# EAGLE design SpringReverbRev2_combined (EAGLE 7.7.0)
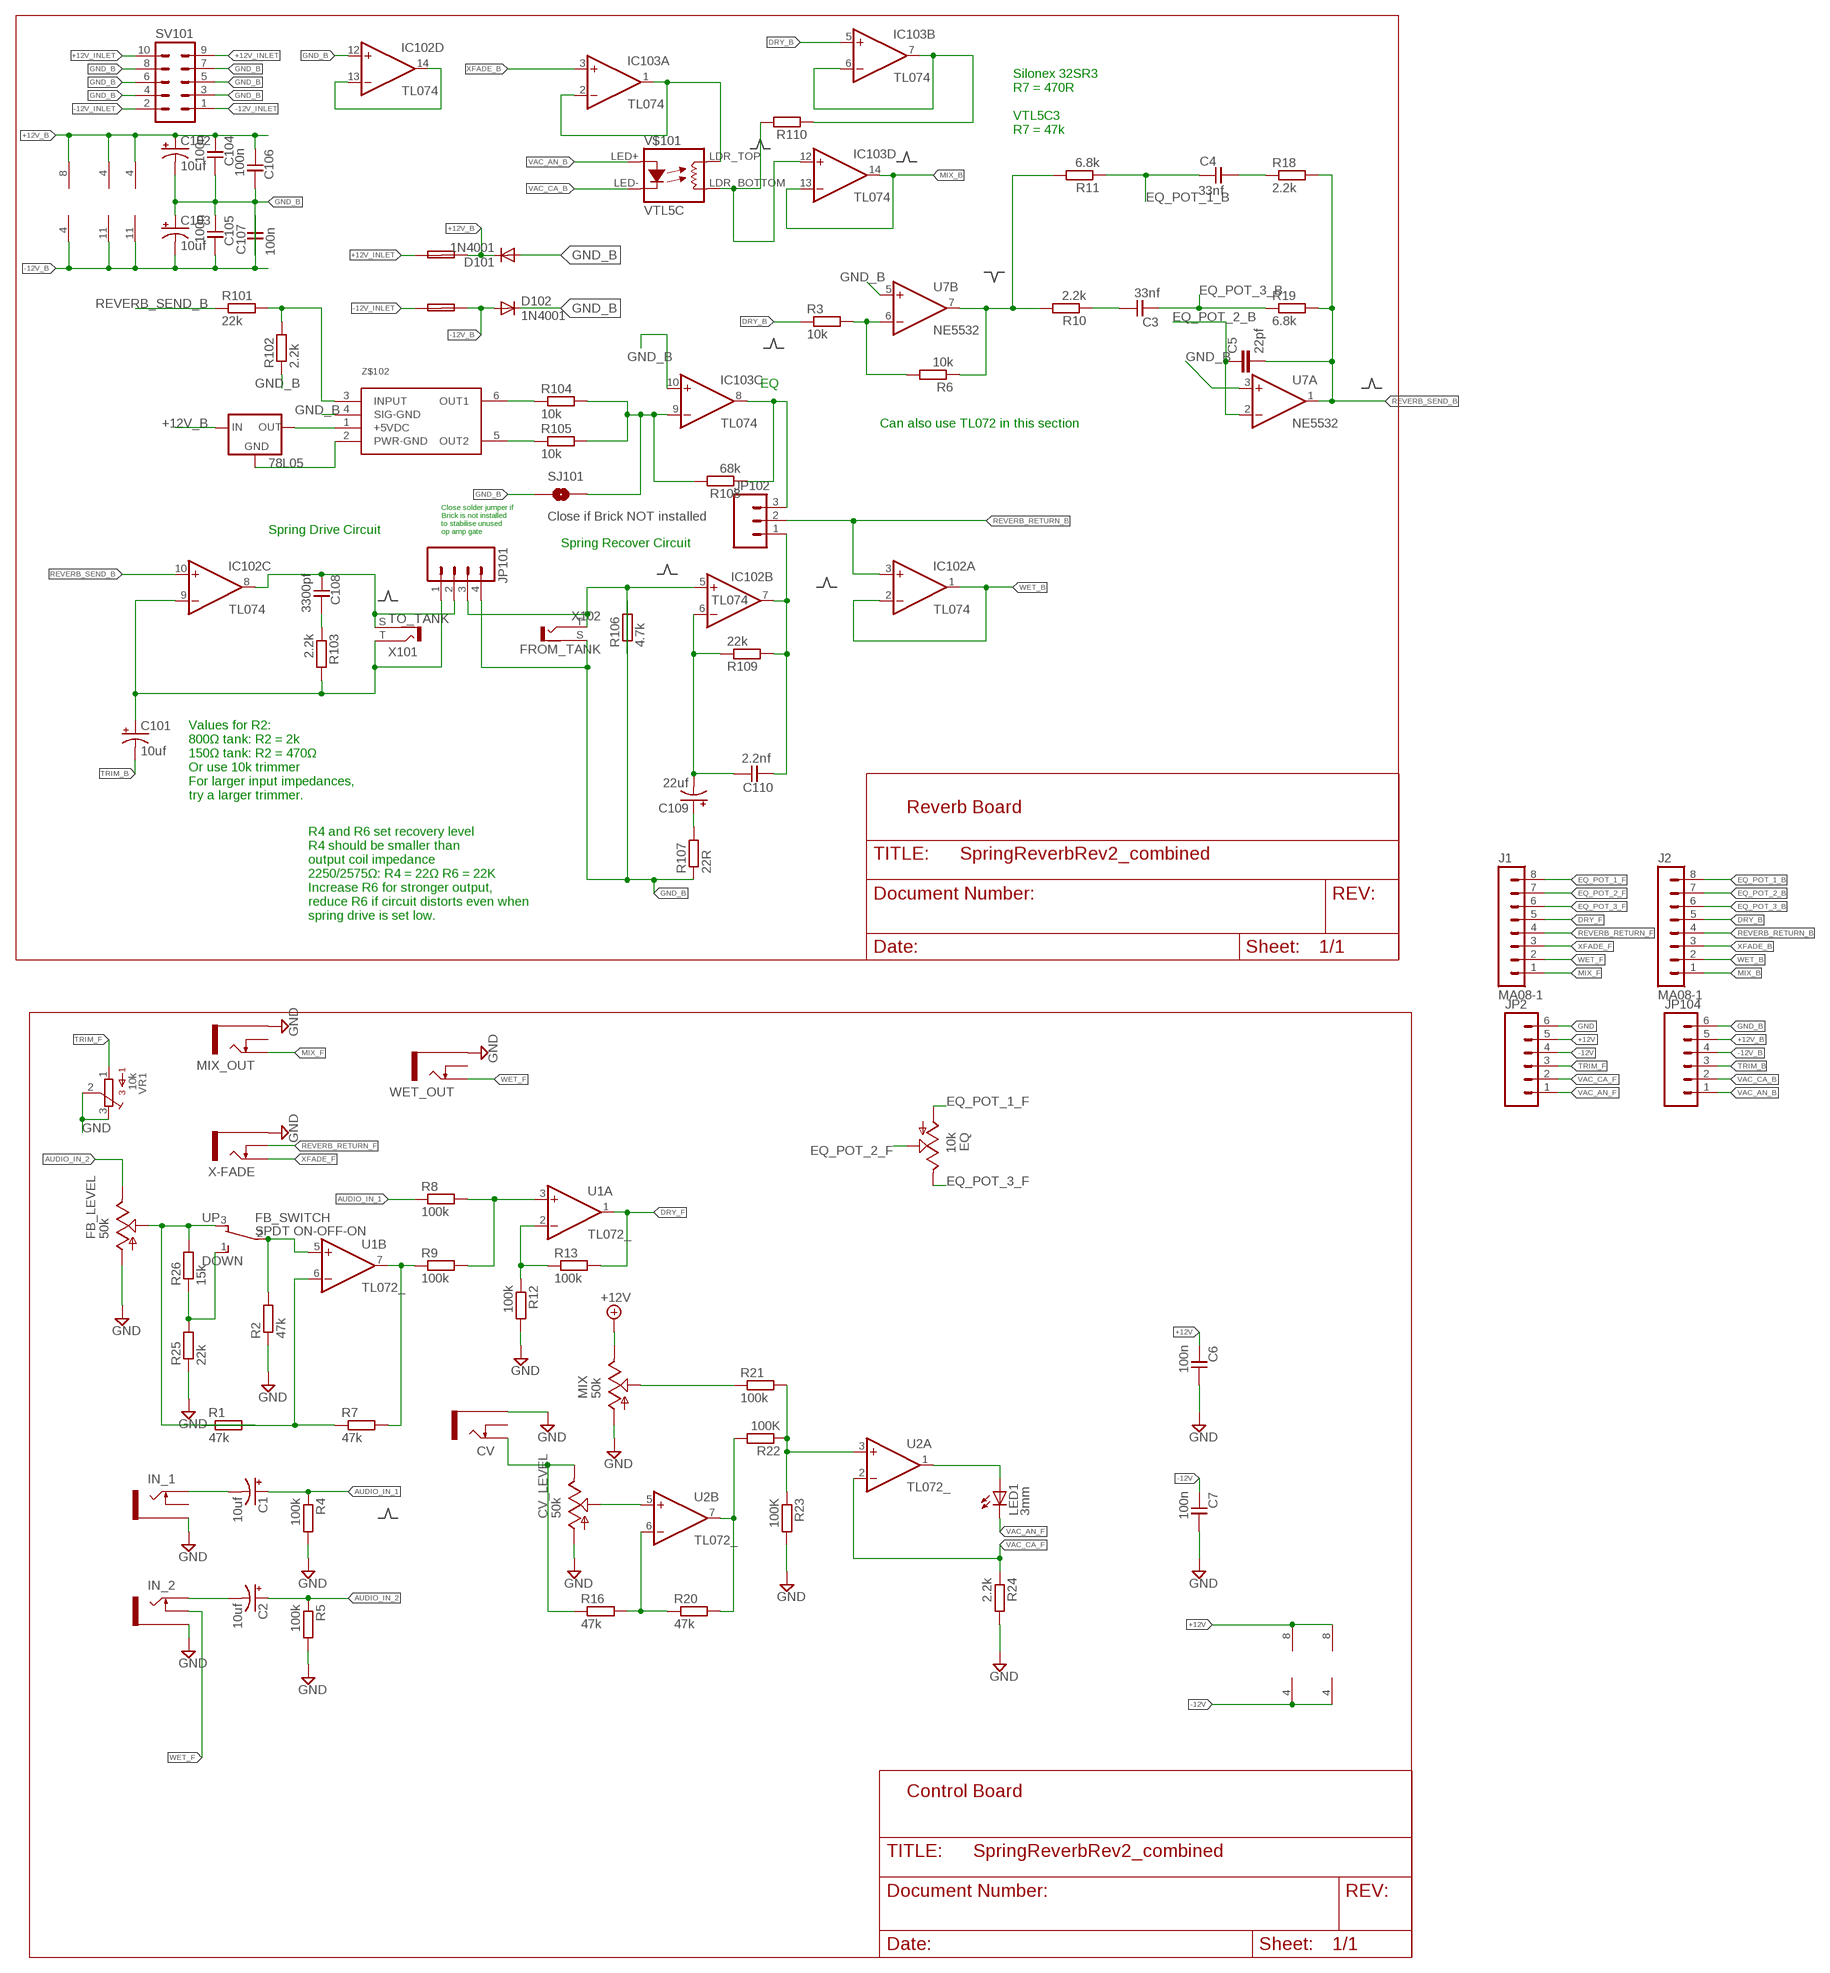
[diagram p0: schematic, sheet 1]

## Parts
78L05  78LXX  [78LXX]
C1  10uf  050  [050_020]
C2  10uf  050  [050_020]
C3  33nf  C-EU050-024X044  [C050-024X044]
C4  33nf  C-EU050-024X044  [C050-024X044]
C5  22pf  050X030_0251  [050X030_025]
C6  100n  C-EU050-024X044  [C050-024X044]
C7  100n  C-EU050-024X044  [C050-024X044]
C101  10uf  CAP_POLPTH2  [CPOL-RADIAL-10UF-25V]
C102  10uf  CAP_POLPTH2  [CPOL-RADIAL-10UF-25V]
C103  10uf  CAP_POLPTH2  [CPOL-RADIAL-10UF-25V]
C104  100n  C-EU050-024X044  [C050-024X044]
C105  100n  C-EU050-024X044  [C050-024X044]
C106  100n  C-EU050-024X044  [C050-024X044]
C107  100n  C-EU050-024X044  [C050-024X044]
C108  3300pf  C-EU050-024X044  [C050-024X044]
C109  22uf  CAP_POLPTH2  [CPOL-RADIAL-10UF-25V]
C110  2.2nf  C-EU050-024X044  [C050-024X044]
CV  THONKICONNNEW  [WQP-PJ301M-12_JACK]
CV_LEVEL  50k  ALPHA-9MMF2A  [EVUF]
D101  1N4001  1N4004  [DO41-10]
D102  1N4001  1N4004  [DO41-10]
EQ  10k  ALPHA-9MMF2A  [EVUF]
F101  FUSE  PTC_FUSEPOLY_FUSE  [C050H075X075]
F102  FUSE  PTC_FUSEPOLY_FUSE  [C050H075X075]
FB_LEVEL  50k  ALPHA-9MMF2A  [EVUF]
FB_SWITCH  SPDT ON-OFF-ON  SPDT-VERTICAL-UPTOP-SUBMINI  [SPDT-VERTICAL-TOP-SUBMINI-MULTICOMP]
IC102  TL074  TL074P  [DIL14]
IC103  TL074  TL074P  [DIL14]
IN_1  THONKICONNNEW  [WQP-PJ301M-12_JACK]
IN_2  THONKICONNNEW  [WQP-PJ301M-12_JACK]
J1  MA08-1  [MA08-1]
J2  MA08-1  [MA08-1]
JP2  M06SIP  [1X06]
JP101  M04POLAR  [MOLEX-1X4]
JP102  M03LOCK_NO_SILK  [1X03_LOCK_NO_SILK]
JP104  M06SIP  [1X06]
LED1  3mm  LED3MM  [LED3MM]
MIX  50k  ALPHA-9MMF2A  [EVUF]
MIX_OUT  THONKICONNNEW  [WQP-PJ301M-12_JACK]
R1  47k  RESISTOR7MM  [7MM_RESISTOR]
R2  47k  RESISTOR7MM  [7MM_RESISTOR]
R3  10k  RESISTOR7MM  [7MM_RESISTOR]
R4  100k  RESISTOR7MM  [7MM_RESISTOR]
R5  100k  RESISTOR7MM  [7MM_RESISTOR]
R6  10k  RESISTOR7MM  [7MM_RESISTOR]
R7  47k  RESISTOR7MM  [7MM_RESISTOR]
R8  100k  RESISTOR7MM  [7MM_RESISTOR]
R9  100k  RESISTOR7MM  [7MM_RESISTOR]
R10  2.2k  RESISTOR7MM  [7MM_RESISTOR]
R11  6.8k  RESISTOR7MM  [7MM_RESISTOR]
R12  100k  RESISTOR7MM  [7MM_RESISTOR]
R13  100k  RESISTOR7MM  [7MM_RESISTOR]
R16  47k  RESISTOR7MM  [7MM_RESISTOR]
R18  2.2k  RESISTOR7MM  [7MM_RESISTOR]
R19  6.8k  RESISTOR7MM  [7MM_RESISTOR]
R20  47k  RESISTOR7MM  [7MM_RESISTOR]
R21  100k  RESISTOR7MM  [7MM_RESISTOR]
R22  100K  RESISTOR7MM  [7MM_RESISTOR]
R23  100K  RESISTOR7MM  [7MM_RESISTOR]
R24  2.2k  RESISTOR7MM  [7MM_RESISTOR]
R25  22k  RESISTOR7MM  [7MM_RESISTOR]
R26  15k  RESISTOR7MM  [7MM_RESISTOR]
R101  22k  RESISTOR7MM  [7MM_RESISTOR]
R102  2.2k  RESISTOR7MM  [7MM_RESISTOR]
R103  2.2k  RESISTOR7MM  [7MM_RESISTOR]
R104  10k  RESISTOR7MM  [7MM_RESISTOR]
R105  10k  RESISTOR7MM  [7MM_RESISTOR]
R106  4.7k  RESISTOR7MM  [7MM_RESISTOR]
R107  22R  RESISTOR7MM  [7MM_RESISTOR]
R108  68k  RESISTOR7MM  [7MM_RESISTOR]
R109  22k  RESISTOR7MM  [7MM_RESISTOR]
R110  RESISTOR7MM  [7MM_RESISTOR]
SJ101  Close if Brick NOT installed  SOLDERJUMPERNC2  [SJ_2S-NOTRACE]
SV101  10_PIN_HEADER  [MA05-2]
U1  TL072_  [DIL08]
U2  TL072_  [DIL08]
U7  NE5532  TL072_  [DIL08]
V$101  VTL5C  VACTROL_COMPACT  [VACTROL_COMPACT]
VR1  10k  BOURNS_3362P_TRIMMERP  [BOURNS_3362P_TRIMMER]
WET_OUT  THONKICONNNEW  [WQP-PJ301M-12_JACK]
X101  TO_TANK  BTOR1  [BTOR1]
X102  FROM_TANK  BTOR1  [BTOR1]
X-FADE  THONKICONNNEW  [WQP-PJ301M-12_JACK]
Z$102  BTDR-2H  [BTDR-2H]

## Nets
+12V [power]: C6.2 JP2.5 MIX.3(E) U1.8(P:V+) U2.8(P:V+)
+12V_B [power]: 78L05.IN C102.1(+) C104.2 C106.2 D101.C F101.1 IC102.4(P:V+) IC103.4(P:V+) JP104.5 U7.8(P:V+)
+12V_INLET: F101.2 SV101.9 SV101.10
-12V [power]: C7.2 JP2.4 U1.4(P:V-) U2.4(P:V-)
-12V_B [power]: C103.2(-) C105.1 C107.1 D102.A F102.1 IC102.11(P:V-) IC103.11(P:V-) JP104.4 U7.4(P:V-)
-12V_INLET: F102.2 SV101.1 SV101.2
AUDIO_IN_1: C1.+ R4.1 R8.1
AUDIO_IN_2: C2.+ FB_LEVEL.3(E) R5.1
AUDIO_IN_BUF: IC103.6(B:-IN) IC103.7(B:OUT) R110.1
BRK: IC103.8(C:OUT) JP102.3 R108.1
CV_F: R20.2 R22.2 U2.7(B:OUT)
DRY_B: IC103.5(B:+IN) J2.5 R3.1
DRY_F: J1.5 R13.2 U1.1(A:OUT)
EQ_POT_1_B: C4.2 J2.8 R11.1
EQ_POT_1_F: EQ.1(A) J1.8
EQ_POT_2_B: C5.1 J2.7 U7.2(A:-IN)
EQ_POT_2_F: EQ.2(S) J1.7
EQ_POT_3_B: C3.2 J2.6 R19.1
EQ_POT_3_F: EQ.3(E) J1.6
GND [ground]: C6.1 C7.1 CV.P$3_SLEEVE(SLEEVE) CV_LEVEL.1(A) FB_LEVEL.1(A) IN_1.P$3_SLEEVE(SLEEVE) IN_2.P$3_SLEEVE(SLEEVE) JP2.6 MIX.1(A) MIX_OUT.P$3_SLEEVE(SLEEVE) R2.1 R4.2 R5.2 R12.2 R23.2 R24.2 R25.1 VR1.2 VR1.3 WET_OUT.P$3_SLEEVE(SLEEVE) X-FADE.P$3_SLEEVE(SLEEVE)
GND_B [ground]: C102.2(-) C103.1(+) C104.1 C105.2 C106.1 C107.2 D101.A D102.C IC102.12(D:+IN) IC103.10(C:+IN) JP101.4 JP104.6 R102.1 R106.2 R107.1 SJ101.1 SV101.3 SV101.4 SV101.5 SV101.6 SV101.7 SV101.8 U7.3(A:+IN) U7.5(B:+IN) X102.S Z$102.4(SIG-GND)
MIX_B: IC103.13(D:-IN) IC103.14(D:OUT) J2.1
MIX_F: J1.1 MIX_OUT.P$1_TIP(TIP)
N$1: C1.- IN_1.P$1_TIP(TIP)
N$2: C2.- IN_2.P$1_TIP(TIP)
N$3: MIX.2(S) R21.1
N$4: FB_LEVEL.2(S) FB_SWITCH.3 R1.2 R26.2
N$5: R1.1 R7.1 U1.6(B:-IN)
N$6: R7.2 R9.1 U1.7(B:OUT)
N$7: R8.2 R9.2 U1.3(A:+IN)
N$8: R21.2 R22.1 R23.1 U2.3(A:+IN)
N$9: R12.1 R13.1 U1.2(A:-IN)
N$10: CV.P$1_TIP(TIP) CV_LEVEL.3(E) R16.1
N$11: LED1.A U2.1(A:OUT)
N$12: FB_SWITCH.1 R25.2 R26.1
N$13: C3.1 R10.1
N$17: C109.1(+) R107.2
N$19: C109.2(-) C110.1 IC102.6(B:-IN) R109.1
N$20: CV_LEVEL.2(S) U2.5(B:+IN)
N$21: C4.1 R18.1
N$23: R16.2 R20.1 U2.6(B:-IN)
N$24: R3.2 R6.2 U7.6(B:-IN)
N$26: C108.1 R103.1
N$27: 78L05.OUT Z$102.1(+5VDC)
N$28: R104.1 Z$102.6(OUT1)
N$29: R105.1 Z$102.5(OUT2)
N$30: IC103.9(C:-IN) R104.2 R105.2 R108.2 SJ101.2
N$31: R6.1 R10.2 R11.2 U7.7(B:OUT)
N$32: R101.2 R102.2 Z$102.3(INPUT)
N$33 [ground]: 78L05.GND Z$102.2(PWR-GND)
N$34 [ground]: IC103.12(D:+IN) R110.2 V$101.LDR_BOTTOM(RES2)
N$35: IC102.13(D:-IN) IC102.14(D:OUT)
N$41: FB_SWITCH.2 R2.2 U1.5(B:+IN)
R+: IC102.5(B:+IN) JP101.3 R106.1 X102.T
REVERB_RETURN_B: IC102.3(A:+IN) J2.4 JP102.2
REVERB_RETURN_F: J1.4 X-FADE.P$2_SWITCH(SWITCH)
REVERB_SEND_B: C5.2 IC102.10(C:+IN) R18.2 R19.2 R101.1 U7.1(A:OUT)
S+: C101.1(+) IC102.9(C:-IN) JP101.1 R103.2 X101.T
S-: C108.2 IC102.8(C:OUT) JP101.2 X101.S
SPNG: C110.2 IC102.7(B:OUT) JP102.1 R109.2
TRIM_B: C101.2(-) JP104.3
TRIM_F: JP2.3 VR1.1
VAC_AN_B: JP104.1 V$101.LED+
VAC_AN_F: JP2.1 LED1.K(C)
VAC_CA_B: JP104.2 V$101.LED-
VAC_CA_F: JP2.2 R24.1 U2.2(A:-IN)
WET_B: IC102.1(A:OUT) IC102.2(A:-IN) J2.2
WET_F: IN_2.P$2_SWITCH(SWITCH) J1.2 WET_OUT.P$1_TIP(TIP)
X_FADE_IN: IC103.1(A:OUT) IC103.2(A:-IN) V$101.LDR_TOP(RES1)
XFADE_B: IC103.3(A:+IN) J2.3
XFADE_F: J1.3 X-FADE.P$1_TIP(TIP)
Unconnected: CV.P$2_SWITCH(SWITCH) IN_1.P$2_SWITCH(SWITCH) MIX_OUT.P$2_SWITCH(SWITCH) WET_OUT.P$2_SWITCH(SWITCH) X101.S@1 X101.S@2 X101.S@3 X102.S@1 X102.S@2 X102.S@3

## Notes on the sheet
- Silonex 32SR3 
  R7 = 470R
  
  VTL5C3 
  R7 = 47k
- EQ
- Can also use TL072 in this section
- Spring Drive Circuit
- Close solder jumper if 
  Brick is not installed
  to stabilise unused
  op amp gate
- Spring Recover Circuit
- Values for R2:
  800Ω tank: R2 = 2k
  150Ω tank: R2 = 470Ω
  Or use 10k trimmer
  For larger input impedances, 
  try a larger trimmer.
- Reverb Board
- R4 and R6 set recovery level 
  R4 should be smaller than 
  output coil impedance
  2250/2575Ω: R4 = 22Ω R6 = 22K 
  Increase R6 for stronger output, 
  reduce R6 if circuit distorts even when 
  spring drive is set low.
- Control Board

## Library data of the parts
78L05 = v-reg:78LXX: VOLTAGE REGULATOR
C1 C2 = gm-caps-electro-pol:050: 0.22 - 100uF Xicon values at Mouser.com: 10V: 10 - 100uF; 16V: 2.2 - 47uF; 25V: 0.47 - 47uF; 50V: 0.22 - 22uF
C3 C4 C6 C7 C104-C108 C110 = TomW:C-EU: CAPACITOR, European symbol
C5 = gm-caps-ceramic:050X030_025: 47 - 120pF Xicon Ceramic Disc 2.5mm lead spacing
C101-C103 C109 = SparkFun-Passives:CAP_POL: Capacitor Polarized These are standard SMD and PTH capacitors. Normally 10uF, 47uF, and 100uF in electrolytic and tantalum varieties. Always verify the external diameter of the through hole cap, it varies with capacity, voltage, and manufacturer. The EIA devices should be standard.
CV IN_1 IN_2 MIX_OUT WET_OUT X-FADE = MusicThingModular:THONKICONN: 3.5mm socket for Eurorack modular synths
CV_LEVEL EQ FB_LEVEL MIX = TomW:ALPHA-9MM: 9 mm Square Rotary Potentiometers Source: Panasonic
D101 D102 = diode:1N4004: DIODE general purpose rectifier, 1 A
F101 F102 = TomW:PTC_FUSE
FB_SWITCH = Monowave_Switches:SPDT-VERTICAL-UP: Vertical SPDT switch in the up position.; SPICE: R{NAME} {2.NET} {3.NET} 1
IC102 IC103 = linear:TL074: OP AMP
J1 J2 = we-con:MA08-1: Pin Header
JP2 JP104 = SparkFun-Connectors:M06: Header 6 Standard 6-pin 0.1" header. Use with straight break away headers (SKU : PRT-00116), right angle break away headers (PRT-00553), swiss pins (PRT-00743), machine pins (PRT-00117), and female headers (PRT-00115). Molex polarized connector foot print use with SKU : PRT-08094 with associated crimp pins and housings. NOTES ON THE VARIANTS LOCK and LOCK_LONGPADS... This footprint was designed to help hold the alignment of a through-hole component (i.e. 6-pin header) while soldering it into place. You may notice that each hole has been shifted either up or down by 0.005 of an inch from it's more standard position (which is a perfectly straight line). This slight alteration caused the pins (the squares in the middle) to touch the edges of the holes. Because they are alternating, it causes a "brace" to hold the component in place. 0.005 has proven to be the perfect amount of "off-center" position when using our standard breakaway headers. Although looks a little odd when you look at the bare footprint, once you have a header in there, the alteration is very hard to notice. Also,if you push a header all the way into place, it is covered up entirely on the bottom side. This idea of altering the position of holes to aid alignment will be further integrated into the Sparkfun Library for other footprints. It can help hold any component with 3 or more connection pins.
JP101 = SparkFun-Connectors:M04: Header 4 Standard 4-pin 0.1" header. Use with straight break away headers (SKU : PRT-00116), right angle break away headers (PRT-00553), swiss pins (PRT-00743), machine pins (PRT-00117), and female headers (PRT-00115). Molex polarized connector foot print use with SKU : PRT-08231 with associated crimp pins and housings. 1MM SMD Version SKU: PRT-10208
JP102 = SparkFun-Connectors:M03: Header 3 Standard 3-pin 0.1" header. Use with straight break away headers (SKU : PRT-00116), right angle break away headers (PRT-00553), swiss pins (PRT-00743), machine pins (PRT-00117), and female headers (PRT-00115). Molex polarized connector foot print use with SKU : PRT-08232 with associated crimp pins and housings.
LED1 = TomW:LED: LED OSRAM: - CHIPLED LG R971, LG N971, LY N971, LG Q971, LY Q971, LO R971, LY R971 LH N974, LH R974 LS Q976, LO Q976, LY Q976 LO Q996 - Hyper CHIPLED LW Q18S LB Q993, LB Q99A, LB R99A - SideLED LS A670, LO A670, LY A670, LG A670, LP A670 LB A673, LV A673, LT A673, LW A673 LH A674 LY A675 LS A676, LA A676, LO A676, LY A676, LW A676 LS A679, LY A679, LG A679 - Hyper Micro SIDELED® LS Y876, LA Y876, LO Y876, LY Y876 LT Y87S - SmartLED LW L88C, LW L88S LB L89C, LB L89S, LG L890 LS L89K, LO L89K, LY L89K LS L896, LA L896, LO L896, LY L896 - TOPLED LS T670, LO T670, LY T670, LG T670, LP T670 LSG T670, LSP T670, LSY T670, LOP T670, LYG T670 LG T671, LOG T671, LSG T671 LB T673, LV T673, LT T673, LW T673 LH T674 LS T676, LA T676, LO T676, LY T676, LB T676, LH T676, LSB T676, LW T676 LB T67C, LV T67C, LT T67C, LS T67K, LO T67K, LY T67K, LW E67C LS E67B, LA E67B, LO E67B, LY E67B, LB E67C, LV E67C, LT E67C LW T67C LS T679, LY T679, LG T679 LS T770, LO T770, LY T770, LG T770, LP T770 LB T773, LV T773, LT T773, LW T773 LH T774 LS E675, LA E675, LY E675, LS T675 LS T776, LA T776, LO T776, LY T776, LB T776 LHGB T686 LT T68C, LB T68C - Hyper Mini TOPLED® LB M676 - Mini TOPLED Santana® LG M470 LS M47K, LO M47K, LY M47K Source: http://www.osram.convergy.de LUXEON: - LUMILED® LXK2-PW12-R00, LXK2-PW12-S00, LXK2-PW14-U00, LXK2-PW14-V00 LXK2-PM12-R00, LXK2-PM12-S00, LXK2-PM14-U00 LXK2-PE12-Q00, LXK2-PE12-R00, LXK2-PE12-S00, LXK2-PE14-T00, LXK2-PE14-U00 LXK2-PB12-K00, LXK2-PB12-L00, LXK2-PB12-M00, LXK2-PB14-N00, LXK2-PB14-P00, LXK2-PB14-Q00 LXK2-PR12-L00, LXK2-PR12-M00, LXK2-PR14-Q00, LXK2-PR14-R00 LXK2-PD12-Q00, LXK2-PD12-R00, LXK2-PD12-S00 LXK2-PH12-R00, LXK2-PH12-S00 LXK2-PL12-P00, LXK2-PL12-Q00, LXK2-PL12-R00 Source: www.luxeon.com KINGBRIGHT: KA-3528ASYC Source: www.kingbright.com
R1-R13 R16 R18-R26 R101-R110 = MusicThingModular:RESISTOR: Standard resistor, various versions
SJ101 = SparkFun-Passives:SOLDERJUMPER: Solder Jumper Standard SMD solder jumper. Used to automate production. Two varients : Normally Open and Normally Closed are the same, but have different paste layers. NC will have a large amount of paste and should jumper during reflow.
SV101 = TomW:10_PIN_HEADER: PIN HEADER; OC_FARNELL: unknown; OC_NEWARK: unknown
U1 U2 U7 = MusicThingModular:TL072: Generic Dual Op Amp
V$101 = TomW:VACTROL_COMPACT
VR1 = MusicThingModular:BOURNS_3362P_TRIMMER: 3362 Series 1/4" Square Trimmer
X101 X102 = con-lumberg:BTOR1: RCA connectors according to JEITA RC-5231 Cinch RCA-Einbaukupplung nach JEITA RC-5231, stehende Ausführung Source: http://www.lumberg.de/Produkte/PDFs/BTOR1.pdf; MPN: BTOR 1; OC_FARNELL: 1217030; OC_NEWARK: 96K7172
Z$102 = Accutronics BTDR-2H:BTDR-2H: Accutronics BTDR-2H Information: http://www.accutronicsreverb.com/main/?skin=sub01_05_1.html

## Net classes
0 default: width 0.203 mm
1 power: width 0.406 mm

## Board
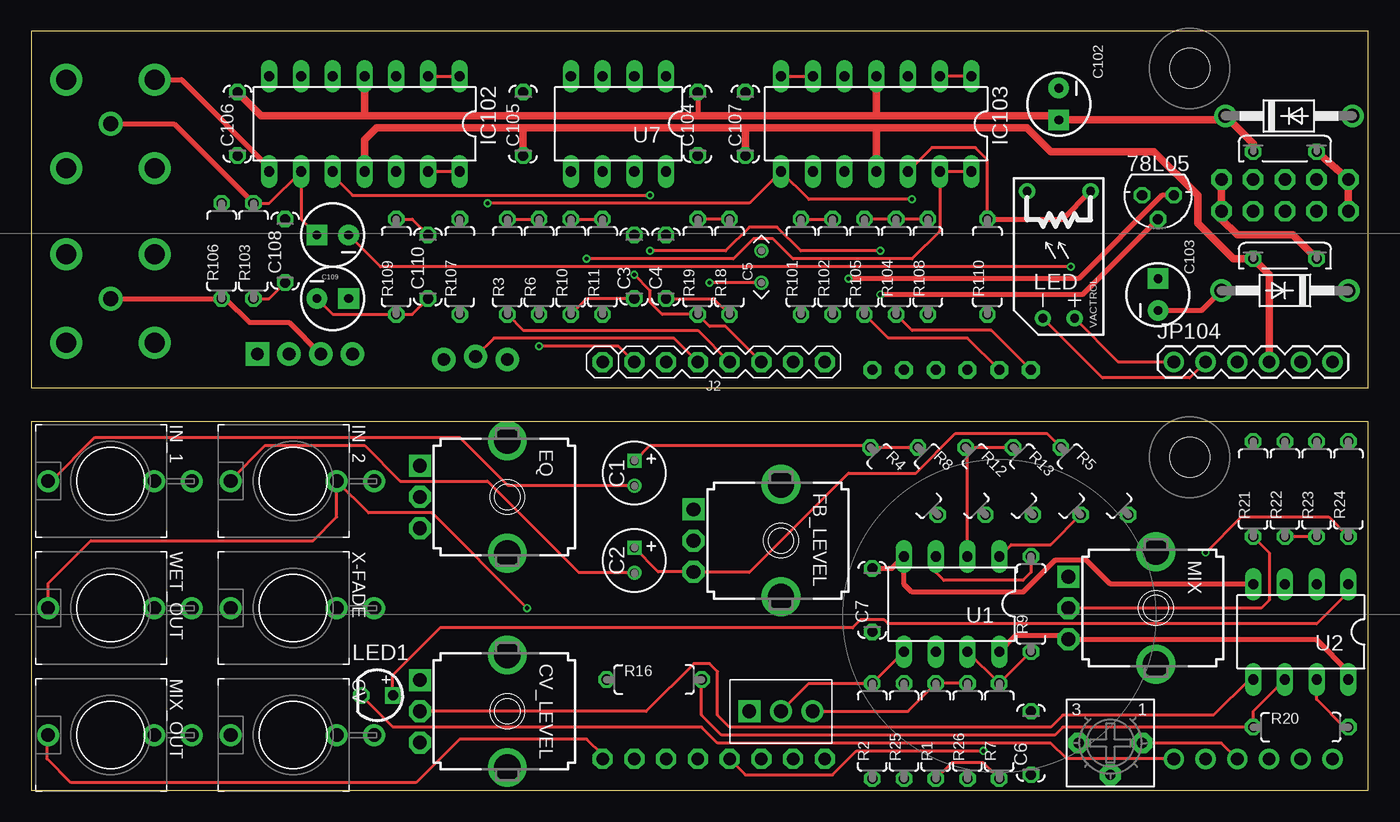
[diagram p1: board, top side]
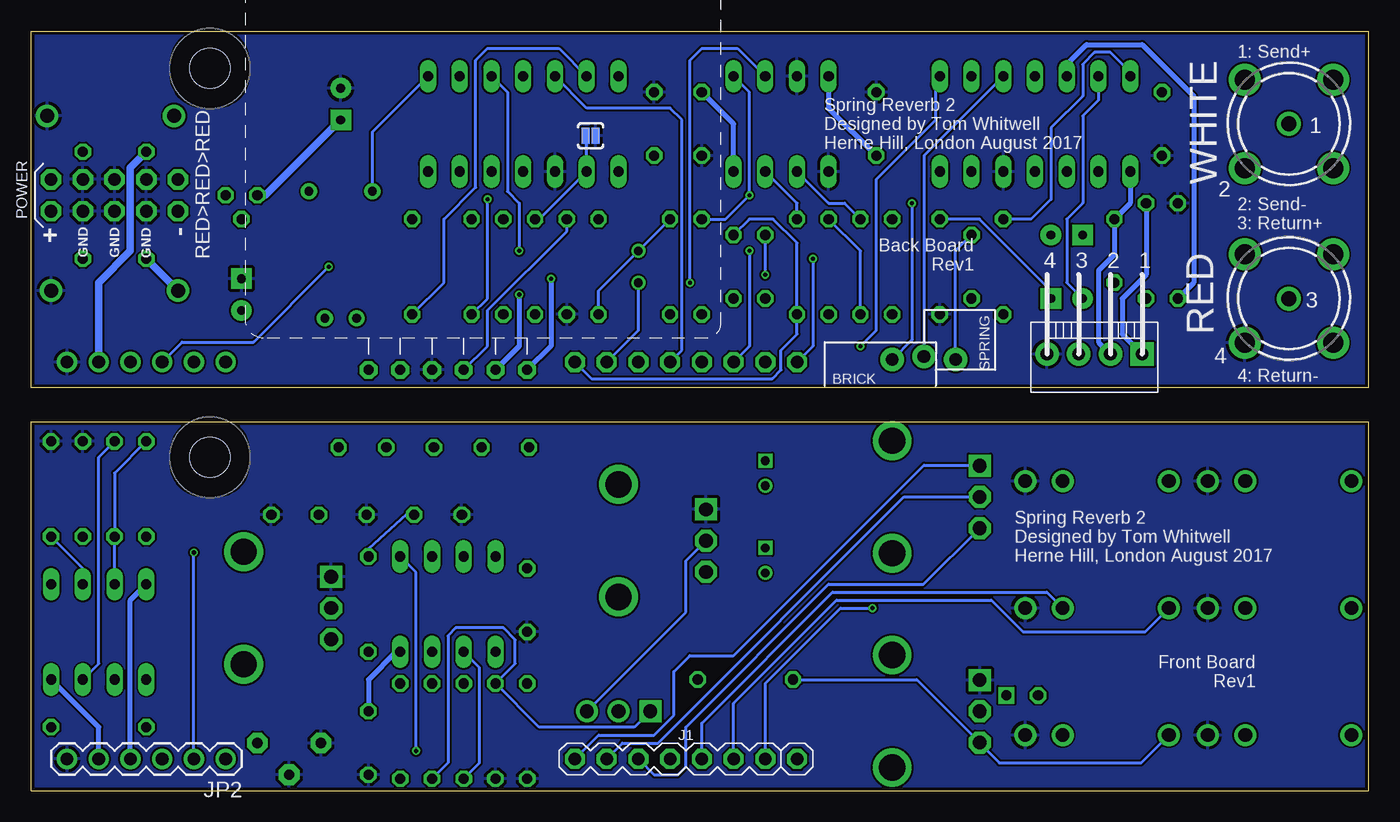
[diagram p2: board, bottom side, seen from below]

Size 107 x 60.75 mm. Coordinates in mm from the lower left corner, seen from the top.
Outline: 107,0 107,29.5 0,29.5 0,0 107,0
Outline: 0,60.75 0,32.25 107,32.25 107,60.75 0,60.75
Copper layers (1*16): Top 0.035mm / dielectric 0.2mm / Bottom 0.035mm
Design rules "SeeedStudio_DRU_no_angle_20130527 *": minimum track width 6mil, minimum drill 12mil, track to track 6mil, track to pad 6mil, pad to pad 6mil, via to via 6mil, smd to smd 0mil, copper to edge 10mil, drill to drill 10mil, minimum pad ring 6mil, minimum via ring 6mil, stop-mask expansion 2mil, vias tented up to drill 25mil, thermal gap 10mil

### Footprints (pad centres in the part's own frame; a part is rotated, then mirrored left to right if it is on the bottom)
78LXX = drill 0.813 octagon: GND 0,1.905; IN 1.27,0; OUT -1.27,0
050_020 = drill 0.7 square: + -1,0 | drill 0.7: - 1,0
C050-024X044 = drill 0.813 octagon: 1 -2.54,0; 2 2.54,0
050X030_025 = drill 0.7: 1 -1.27,0; 2 1.27,0
CPOL-RADIAL-10UF-25V = drill 0.7 pad 1.651 square: 1 1.27,0 | drill 0.7 pad 1.651: 2 -1.27,0
WQP-PJ301M-12_JACK = drill 1.1: P$1_TIP 0,5; P$2_SWITCH 0,-3.5; P$3_SLEEVE 0,-6.5
EVUF = drill 1.1 square: 1 -2.5,-7 | drill 1.1 octagon: 2 0,-7; 3 2.5,-7 | drill 2.1: M1 4.5,0; M2 -4.5,0
DO41-10 = drill 1.118: A 5.08,0; C -5.08,0
C050H075X075 = drill 0.813 octagon: 1 -2.54,0; 2 2.54,0
SPDT-VERTICAL-TOP-SUBMINI-MULTICOMP = drill 1.1 square: 1 0,2.54 | drill 1.1: 2 0,0; 3 0,-2.54
DIL14 = drill 0.813 long: 1 -7.62,-3.81; 2 -5.08,-3.81; 3 -2.54,-3.81; 4 0,-3.81; 5 2.54,-3.81; 6 5.08,-3.81; 7 7.62,-3.81; 8 7.62,3.81; 9 5.08,3.81; 10 2.54,3.81; 11 0,3.81; 12 -2.54,3.81; 13 -5.08,3.81; 14 -7.62,3.81
MA08-1 = drill 1 octagon: 1 0,8.89; 2 0,6.35; 3 0,3.81; 4 0,1.27; 5 0,-1.27; 6 0,-3.81; 7 0,-6.35; 8 0,-8.89
1X06 = drill 1.016: 1 0,0; 2 2.54,0; 3 5.08,0; 4 7.62,0; 5 10.16,0; 6 12.7,0
MOLEX-1X4 = drill 1.016 pad 1.88 square: 1 0,0 | drill 1.016 pad 1.88: 2 2.54,0; 3 5.08,0; 4 7.62,0
1X03_LOCK_NO_SILK = drill 1.016 pad 1.88: 1 0,0.127; 2 2.54,-0.127; 3 5.08,0.127
LED3MM = drill 0.813 square: A -1.27,0 | drill 0.813 octagon: K 1.27,0
7MM_RESISTOR = drill 0.813 octagon: 1 -3.81,0; 2 3.81,0
SJ_2S-NOTRACE = smd 0.635 x 1.27: 1 -0.401,0; 2 0.413,0
MA05-2 = drill 1.016 octagon: 1 -5.08,-1.27; 2 -5.08,1.27; 3 -2.54,-1.27; 4 -2.54,1.27; 5 0,-1.27; 6 0,1.27; 7 2.54,-1.27; 8 2.54,1.27; 9 5.08,-1.27; 10 5.08,1.27
DIL08 = drill 0.813 pad 1.27 long: 1 -3.81,-3.81; 2 -1.27,-3.81; 3 1.27,-3.81; 4 3.81,-3.81; 5 3.81,3.81; 6 1.27,3.81; 7 -1.27,3.81; 8 -3.81,3.81
MOUNTING_HOLE = hole 3.2: 0,0
VACTROL_COMPACT = drill 0.7 pad 1.3: LDR_BOTTOM 5.08,-2.54; LDR_TOP 5.08,2.54; LED+ -5.08,-1.27; LED- -5.08,1.27
BOURNS_3362P_TRIMMER = drill 0.813 pad 1.676 octagon: 1 -2.54,0; 2 0,2.54; 3 2.54,0
BTOR1 = drill 1.6 pad 2.2: S -5,0; S@1 0,5; S@2 5,0; S@3 0,-5 | drill 1.2 pad 1.6: T 0,0
BTDR-2H = drill 0.8 pad 1.422 octagon: 1 2.54,-17.78; 2 0,-17.78; 3 -2.54,-17.78; 4 -5.08,-17.78; 5 -7.62,-17.78; 6 -10.16,-17.78

### Placement (x,y rotation side)
78L05  90.17,47.62 180 top
C1  48.26,25.4 270 top
C2  48.26,18.41 270 top
C3  48.26,41.91 90 top
C4  50.8,41.91 90 top
C5  58.42,41.91 90 top
C6  80.01,3.81 90 top
C7  67.31,15.24 90 top
C101  24.13,44.45 180 top
C102  82.23,54.93 270 top
C103  90.17,39.69 90 top
C104  53.34,53.34 90 top
C105  39.37,53.34 90 top
C106  16.51,53.34 90 top
C107  57.15,53.34 90 top
C108  20.32,43.18 90 top
C109  24.13,39.37 0 top
C110  31.75,41.91 90 top
CV  20.95,4.45 90 top
CV_LEVEL  38.1,6.35 270 top
D101  100.65,53.98 0 top
D102  100.33,40.01 180 top
EQ  38.1,23.5 270 top
F101  100.33,51.12 0 top
F102  100.33,42.55 0 top
FB_LEVEL  60,20 270 top
FB_SWITCH  60,6.35 90 top
IC102  26.67,53.34 180 top
IC103  67.63,53.34 180 top
IN_1  6.35,24.77 90 top
IN_2  20.95,24.77 90 top
J1  54.61,2.54 270 bottom
J2  54.61,34.29 90 top
JP2  91.44,2.54 180 bottom
JP101  18.1,34.92 180 bottom
JP102  33.02,34.61 180 bottom
JP104  91.44,34.29 0 top
LED1  27.69,7.62 180 top
MIX  90,14.61 270 top
MIX_OUT  6.35,4.45 90 top
R1  72.39,4.76 90 top
R2  67.31,4.76 90 top
R3  38.1,41.91 90 top
R4  69.85,24.77 315 top
R5  85.09,24.77 315 top
R6  40.64,41.91 90 top
R7  77.47,4.76 90 top
R8  73.66,24.77 315 top
R9  80.01,14.92 90 top
R10  43.18,41.91 90 top
R11  45.72,41.91 90 top
R12  77.47,24.77 315 top
R13  81.28,24.77 315 top
R16  49.85,8.89 0 top
R18  55.88,41.91 90 top
R19  53.34,41.91 90 top
R20  101.6,5.08 0 top
R21  97.79,24.13 90 top
R22  100.33,24.13 90 top
R23  102.87,24.13 90 top
R24  105.41,24.13 90 top
R25  69.85,4.76 90 top
R26  74.93,4.76 90 top
R101  61.59,41.91 90 top
R102  64.14,41.91 90 top
R103  17.78,43.18 90 top
R104  69.22,41.91 90 top
R105  66.67,41.91 90 top
R106  15.24,43.18 90 top
R107  34.29,41.91 90 top
R108  71.75,41.91 90 top
R109  29.21,41.91 90 top
R110  76.52,41.91 90 top
SJ101  62.23,52.39 180 bottom
SV101  100.33,47.62 180 bottom
U1  73.66,14.92 180 top
U2  101.6,12.7 180 top
U7  46.99,53.34 180 top
U$3  [MOUNTING_HOLE]  92.71,26.67 0 top
U$4  [MOUNTING_HOLE]  92.71,57.78 0 top
V$101  82.23,42.86 90 top
VR1  86.36,3.81 180 top
WET_OUT  6.35,14.61 90 top
X101  6.35,53.34 315 bottom
X102  6.35,39.37 45 bottom
X-FADE  20.95,14.61 90 top
Z$102  69.85,51.44 0 bottom

### Tracks (layer width: path | path; a pad name or v marks a point on that pad's centre or on a via)
+12V
  Top 0.406: U1.8 78.74,12.38 82.55,12.38 82.83,12.11 MIX.3 102.83,12.11 105.41,9.53 U2.8
  Bottom 0.406: JP2.5 101.6,5.08 U2.8 | U1.8 77.79,11.11 80.01,8.89 C6.2
+12V_B
  Top 0.406: C102.1 81.92,53.98 | 26.67,54.29 26.35,53.98 | C104.2 53.34,53.98
  Top 0.61: F101.1 97.79,51.75 D101.C 94.93,53.66 C102.1 | 81.92,53.98 67.63,53.98 | 67.63,53.98 53.34,53.98 26.35,53.98 18.41,53.98 C106.2 | IC102.4 26.67,54.29 | IC103.4 67.63,53.98
  Bottom 0.406: U7.8 50.8,53.34 C104.2
  Bottom 0.61: 78L05.IN 88.27,47.62 C102.1 | JP104.5 101.6,40.64 99.06,43.18 99.06,49.85 F101.1
+12V_INLET
  Top 0.61: SV101.10 SV101.9 F101.2
-12V
  Top 0.406: U2.4 86.36,16.51 84.45,18.41 81.92,18.41 79.38,15.88 70.48,15.88 69.85,16.51 U1.4 68.9,17.78 C7.2
  Bottom 0.406: JP2.4 99.06,15.24 U2.4
-12V_B
  Top 0.406: 39.37,52.7 39.69,53.02 | C103.2 93.66,38.42 D102.A
  Top 0.61: 67.63,53.02 79.69,53.02 81.6,51.12 89.85,51.12 93.34,47.62 93.34,45.4 96.2,42.55 F102.1 99.06,41.27 JP104.4 | 67.63,53.02 57.15,53.02 | 57.15,53.02 39.69,53.02 27.62,53.02 26.67,52.07 IC102.11 | C105.1 39.37,52.7 | IC103.11 67.63,53.02 | C107.1 57.15,53.02
  Bottom 0.406: U7.4 43.18,54.61 C105.1
  Bottom 0.61: D102.A F102.1
-12V_INLET
  Top 0.61: SV101.1 SV101.2 95.25,45.72 96.52,44.45 100.97,44.45 F102.2
AUDIO_IN_1
  Top 0.254: C1.+ 48.31,26.35 48.31,26.4 49.53,27.62 66.99,27.62 R4.1 R8.1
AUDIO_IN_2
  Top 0.254: C2.+ 50.17,17.5 FB_LEVEL.3 53.04,17.46 57.47,17.46 65.41,25.4 70.8,25.4 73.98,28.57 81.28,28.57 R5.1
AUDIO_IN_BUF
  Top 0.254: IC103.7 IC103.6
  Bottom 0.254: R110.1 73.98,40.64 73.98,45.72 71.44,48.26 71.44,58.42 70.48,59.37 64.77,59.37 IC103.6
BRK  (via drill 0.33)
  Top 0.254: v70.48,47.31 62.23,47.31 IC103.8 57.47,46.99 v36.51,46.99
  Bottom 0.254: R108.1 70.48,39.37 v70.48,47.31 | v36.51,46.99 36.51,36.07 JP102.3
CV_F
  Top 0.254: R20.2 105.09,5.08 102.87,7.3 U2.7
  Bottom 0.254: U2.7 101.6,10.16 101.6,26.67 R22.2
DRY_B
  Top 0.254: R3.1 39.37,36.83 53.34,36.83 J2.5
  Bottom 0.254: J2.5 54.93,35.24 54.93,53.66 55.88,54.61 62.55,54.61 IC103.5
DRY_F  (via drill 0.33)
  Top 0.254: J1.5 57.15,1.27 64.14,1.27 66.04,3.17 v76.2,3.17 | U1.1 78.42,19.68 81.59,19.68 R13.2
  Bottom 0.254: v76.2,3.17 76.2,17.46 U1.1
EQ_POT_1_B
  Bottom 0.254: J2.8 62.17,32.96 47.69,32.96 46.99,33.66 46.99,35.24 45.72,36.51 R11.1 45.72,43.81 47.62,45.72 49.53,45.72 C4.2
EQ_POT_1_F
  Bottom 0.254: J1.8 61.59,4.45 57.15,4.45 55.56,6.03 55.56,9.53 54.29,10.79 50.8,10.79 35.56,26.04 31.14,26.04 EQ.1
EQ_POT_2_B  (via drill 0.33)
  Top 0.254: C5.1 v54.29,40.64
  Bottom 0.254: J2.7 58.42,36.83 C5.1 | v54.29,40.64 54.29,58.42 53.34,59.37 50.48,59.37 U7.2
EQ_POT_2_F
  Bottom 0.254: J1.7 59.69,3.81 56.83,3.81 37.15,23.5 EQ.2
EQ_POT_3_B  (via drill 0.33)
  Top 0.254: J2.6 55.56,37.15 54.29,37.15 R19.1 50.48,38.1 49.53,39.05 49.53,40.01 v48.26,41.27
  Bottom 0.254: v48.26,41.27 C3.2
EQ_POT_3_F
  Bottom 0.254: J1.6 57.15,1.27 55.24,1.27 54.61,1.91 54.61,5.08 43.18,16.51 35.59,16.51 EQ.3
GND
  pour Bottom: -0.32,29.53 107,29.53 107,0 0,0
GND_B
  pour Bottom: -0.32,32.07 107.31,32.07 107.31,60.96 -0.32,60.96
MIX_B  (via drill 0.33)
  Top 0.254: IC103.14 IC103.13 72.71,44.77 70.48,42.55 60.96,42.55 59.37,44.13 57.78,44.13 56.2,42.55 v44.45,42.55
  Bottom 0.254: v44.45,42.55 44.45,35.56 J2.1
MIX_F
  Top 0.254: J1.1 45.72,2.86 44.45,4.13 34.29,4.13 30.8,0.64 3.17,0.64 1.27,2.54 1.27,4.37 MIX_OUT.P$1_TIP
N$1
  Top 0.254: IN_1.P$1_TIP 1.59,24.77 5.08,28.26 34.29,28.26 38.1,24.45 48.21,24.45 C1.-
N$2
  Top 0.254: IN_2.P$1_TIP 15.96,24.84 18.73,27.62 26.67,27.62 29.53,24.77 36.51,24.77 43.81,17.46 48.21,17.46 C2.-
N$3
  Top 0.254: R21.1 99.06,19.05 99.06,15.24 98.42,14.61 MIX.2
N$4
  Top 0.254: R26.2 R1.2 70.17,6.35 FB_SWITCH.3
  Bottom 0.254: FB_SWITCH.3 54.61,14.29 54.61,18.39 FB_LEVEL.2
N$5
  Top 0.254: R7.1 76.2,2.22 73.66,2.22 R1.1
  Bottom 0.254: R1.1 71.12,2.22 71.12,9.84 U1.6
N$6
  Top 0.254: R9.1 R7.2 U1.7
N$7
  Top 0.254: R9.2 80.01,17.46 79.38,16.83 73.03,16.83 72.39,17.46 U1.3
  Bottom 0.254: R8.2 76.99,22.07 80.01,19.37 R9.2
N$8
  Top 0.254: R23.1 R22.1
  Bottom 0.254: R21.2 100.33,25.4 R22.1 U2.3
N$9
  Top 0.254: U1.2 74.93,27.3 R12.1 R13.1
N$10
  Bottom 0.254: R16.1 36.14,8.89 CV_LEVEL.3 31.1,3.79 29.53,2.22 18.18,2.22 CV.P$1_TIP
N$11
  Top 0.254: U2.1 105.41,15.88 102.87,13.34 68.58,13.34 68.26,13.65 66.36,13.65 65.72,13.02 32.7,13.02 28.89,9.21 28.89,7.68 LED1.A
N$12
  Bottom 0.254: FB_SWITCH.1 58.74,5.08 66.36,5.08 R25.2 68.26,10.16 68.26,12.06 69.22,13.02 73.03,13.02 73.66,12.38 73.66,2.22 R26.1
N$13
  Top 0.254: C3.1 44.45,39.37 R10.1
N$17
  Bottom 0.254: C109.1 25.4,40.01 31.11,45.72 R107.2
N$19
  Top 0.254: C109.2 24.13,38.1 R109.1 30.48,38.1 C110.1
  Bottom 0.254: C109.2 24.13,40.64 24.13,45.72 22.86,46.99 22.86,53.98 21.59,55.24 IC102.6
N$20
  Top 0.254: U2.5 97.47,8.89 94.61,6.03 82.55,6.03 81.6,5.08 55.88,5.08 54.93,6.03 54.93,9.53 54.29,10.16 53.02,10.16 49.21,6.35 CV_LEVEL.2
N$21
  Top 0.254: C4.1 54.61,39.37 R18.1
N$23
  Top 0.254: U2.6 97.79,6.35 R20.1 82.55,5.08 81.92,4.45 55.24,4.45 53.66,6.03 R16.2
N$24
  Top 0.254: R3.2 R6.2
  Bottom 0.254: U7.6 43.18,46.99 41.91,46.99 R6.2
N$26
  Top 0.254: R103.1 19.05,39.37 C108.1
N$27  (via drill 0.33)
  Top 0.406: 78L05.OUT 90.49,47.62 83.82,40.96 v65.41,40.96
  Bottom 0.406: v65.41,40.96 65.41,35.56 Z$102.1
N$28
  Top 0.254: Z$102.6 76.83,36.83 70.48,36.83 R104.1
N$29
  Top 0.254: Z$102.5 74.93,36.2 68.58,36.2 R105.1
N$30
  Top 0.254: R108.2 R104.2 R105.2
  Bottom 0.254: R105.2 66.36,45.72 IC103.9 62.55,51.66 SJ101.2
N$31
  Top 0.254: R10.2 R11.2
  Bottom 0.254: R6.1 40.64,43.18 R10.2 | R11.2 45.72,46.99 U7.7
N$32
  Top 0.254: R101.2 R102.2
  Bottom 0.254: Z$102.3 70.48,35.56 70.48,38.42 64.14,44.77 R102.2
N$33  (via drill 0.33)
  Top 0.406: 78L05.GND 84.14,39.69 v67.94,39.69
  Bottom 0.406: v67.94,39.69 67.94,35.56 Z$102.2
N$34
  Top 0.254: R110.2 76.52,50.48 75.56,51.44 72.07,51.44 IC103.12
  Top 0.406: R110.2 82.55,45.72 V$101.LDR_BOTTOM
N$35
  Top 0.254: IC102.14 IC102.13
N$41
  Top 0.254: FB_SWITCH.2 62.23,8.57 R2.2 U1.5
R+
  Top 0.406: X102.T R106.1 15.56,39.37 17.46,37.47 20.64,37.47 JP101.3
  Bottom 0.406: IC102.5 24.13,58.1 22.54,59.69 18.1,59.69 13.97,55.56 13.97,40.64 R106.1
REVERB_RETURN_B
  Top 0.254: J2.4 51.44,36.2 37.02,36.2 JP102.2
  Bottom 0.254: IC102.3 35.56,50.8 JP102.2
REVERB_RETURN_F
  Bottom 0.254: J1.4 53.34,5.4 42.86,15.88 25.73,15.88 X-FADE.P$2_SWITCH
REVERB_SEND_B  (via drill 0.33)
  Top 0.254: R18.2 R19.2 | IC102.10 24.13,49.21 25.72,47.62 v49.53,47.62
  Bottom 0.254: R101.1 61.59,40.01 C5.2 R18.2 | R19.2 51.44,45.72 v49.53,47.62 49.53,55.88 U7.1
S+
  Top 0.254: R103.2 19.05,46.99 IC102.9 21.59,45.72 C101.1
  Top 0.406: X101.T 11.43,53.34 R103.2
  Bottom 0.406: R103.2 17.78,41.27 19.68,39.37 19.68,36.51 JP101.1
S-
  Top 0.254: 19.05,49.85 IC102.8
  Top 0.406: X101.S 12.02,56.88 19.05,49.85
  Bottom 0.406: IC102.8 19.05,46.99 C108.2 20.32,42.86 21.59,41.59 21.59,35.88 JP101.2
SPNG
  Top 0.254: R109.2 30.48,45.72 C110.2
  Bottom 0.254: JP102.1 33.02,43.18 C110.2 | R109.2 26.99,45.72 25.4,47.31 25.4,53.02 22.86,55.56 22.86,58.1 21.91,59.05 20.64,59.05 19.05,57.47 IC102.7
TRIM_B  (via drill 0.33)
  Top 0.254: v83.19,41.91 27.94,41.91 C101.2
  Bottom 0.254: JP104.3 94.93,35.88 89.22,35.88 v83.19,41.91
TRIM_F
  Top 0.254: JP2.3 95.25,3.81 VR1.1
VAC_AN_B
  Top 0.254: JP104.1 87,34.29 V$101.LED+
VAC_AN_F
  Top 0.254: JP2.1 82.87,2.54 81.6,3.81 54.93,3.81 53.66,5.08 28.96,5.08 LED1.K
VAC_CA_B
  Top 0.254: JP104.2 92.71,33.02 85.72,33.02 V$101.LED-
VAC_CA_F  (via drill 0.33)
  Top 0.254: v93.98,19.05 96.84,21.91 103.82,21.91 R24.1
  Bottom 0.254: U2.2 102.87,17.78 R24.1 | JP2.2 v93.98,19.05
WET_B  (via drill 0.33)
  Top 0.254: J2.2 46.99,35.56 v40.64,35.56 | IC102.2 IC102.1
  Bottom 0.254: v40.64,35.56 39.37,36.83 39.37,48.9 34.61,53.66 34.61,56.83 IC102.1
WET_F  (via drill 0.33)
  Top 0.254: WET_OUT.P$1_TIP 1.35,16.59 4.76,20 22.54,20 24.45,21.91 24.45,24.76 IN_2.P$2_SWITCH 27,22.23 32.07,22.23 v39.69,14.61
  Bottom 0.254: J1.2 48.26,8.57 42.23,14.61 v39.69,14.61
X_FADE_IN
  Top 0.254: IC103.1 IC103.2
  Bottom 0.254: V$101.LDR_TOP 79.69,52.7 IC103.1
XFADE_B  (via drill 0.33)
  Top 0.254: v67.94,43.18 61.59,43.18 59.69,45.09 57.47,45.09 55.56,43.18 v49.53,43.18
  Bottom 0.254: IC103.3 68.9,55.88 68.9,47.94 67.94,46.99 v67.94,43.18 | v49.53,43.18 49.53,35.56 J2.3
XFADE_F
  Bottom 0.254: J1.3 50.8,6.99 42.55,15.24 30.16,15.24 27.62,12.7 17.86,12.7 X-FADE.P$1_TIP

### Text on the board
bPlace: WHITE | Spring Reverb 2 / Designed by Tom Whitwell / Herne Hill, London August 2017 | 1 | 2 | 1 | 2 | 3 | 4 | Back Board / Rev1 | 3 | SPRING | RED | 4 | 1: Send+ / / / / / / / / 2: Send- / 3: Return+ / / / / / / / / 4: Return- | BRICK | Spring Reverb 2 / Designed by Tom Whitwell / Herne Hill, London August 2017 | Front Board / Rev1